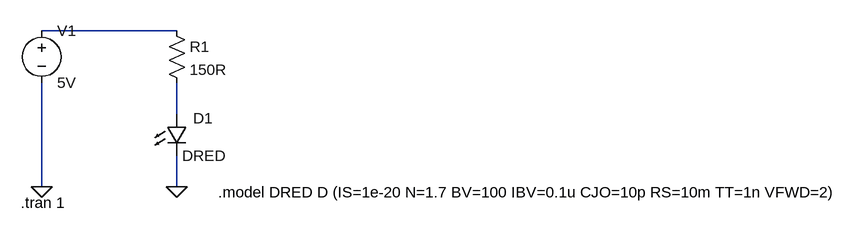
[diagram p0: schematic LED + Resistor Circuit.asc]
LED + Resistor Circuit.asc, the LTspice schematic file:
Version 4.1
SHEET 1 1300 680
WIRE 208 32 0 32
WIRE 208 160 208 112
WIRE 0 272 0 112
WIRE 208 272 208 224
FLAG 208 272 0
FLAG 0 272 0
SYMBOL voltage 0 16 R0
WINDOW 123 0 0 Left 0
WINDOW 39 0 0 Left 0
SYMATTR InstName V1
SYMATTR Value 5V
SYMBOL res 192 16 R0
SYMATTR InstName R1
SYMATTR Value 150R
SYMBOL LED 192 160 R0
WINDOW 0 41 6 Left 2
SYMATTR InstName D1
SYMATTR Value DRED
TEXT -32 296 Left 2 !.tran 1
TEXT 272 280 Left 2 !.model DRED D (IS=1e-20 N=1.7 BV=100 IBV=0.1u CJO=10p RS=10m TT=1n VFWD=2)

The netlist it stands for:
* LED + Resistor Circuit.asc
V1 N001 0 5V
R1 N001 N002 150R
D1 N002 0 DRED
.model D D
.lib standard.dio
.tran 1
.model DRED D (IS=1e-20 N=1.7 BV=100 IBV=0.1u CJO=10p RS=10m TT=1n VFWD=2)
.backanno
.end